# Altium schematic sheet Interface.SchDoc
size A4; SheetNumber: 3; SheetTotal: 4
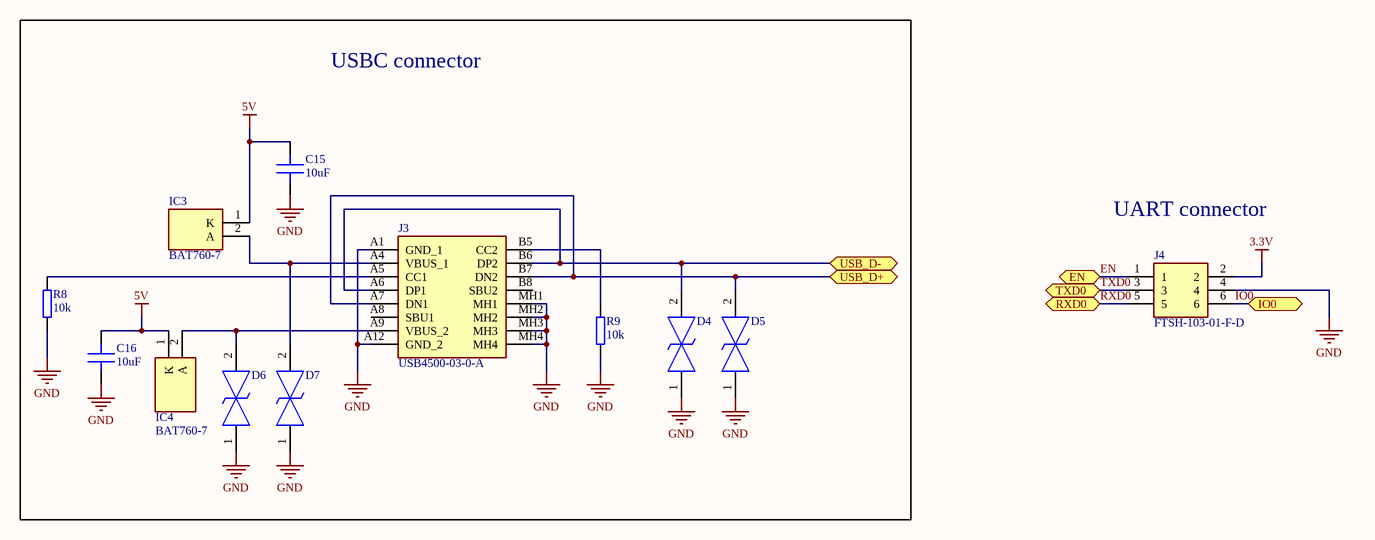
[diagram p0: Interface.SchDoc]

## Parts
C15  10uF  [C 0402]
C16  10uF  [C 0402]
D4  LESD5D5.0CT1G  [LESD5D50CT1G]  (value not drawn)
D5  LESD5D5.0CT1G  [LESD5D50CT1G]  (value not drawn)
D6  LESD5D5.0CT1G  [LESD5D50CT1G]  (value not drawn)
D7  LESD5D5.0CT1G  [LESD5D50CT1G]  (value not drawn)
IC3  BAT760-7  [SOD2513X120N]
IC4  BAT760-7  [SOD2513X120N]
J3  USB4500-03-0-A  [USB4500030A]
J4  FTSH-103-01-F-D  [FTSH-103-XX-YYY-D]
R8  10k  [R 0402]
R9  10k  [R 0402]

## Blocks framed on the sheet
USBC connector: C15 C16 D4-D7 IC3 IC4 J3 R8 R9

## Ports
EN (bidir), IO0 (bidir), RXD0 (bidir), TXD0 (bidir), USB_D+ (bidir), USB_D- (bidir)

## Nets
3.3V: J4.2
5V: C15.1 C16.1 IC3.1(K) IC4.1(K)
GND: C15.2 C16.2 D4.1 D5.1 D6.1 D7.1 J3.A1(GND_1) J3.A12(GND_2) J3.MH1 J3.MH2 J3.MH3 J3.MH4 J4.4 R8.1 R9.1
EN: J4.1 ; port EN
IO0: J4.6 ; port IO0
RXD0: J4.5 ; port RXD0
TXD0: J4.3 ; port TXD0
USB_D+: D5.2 J3.A7(DN1) J3.B7(DN2) ; port USB_D+
USB_D-: D4.2 J3.A6(DP1) J3.B6(DP2) ; port USB_D-
NetD6_2: D6.2 IC4.2(A) J3.A9(VBUS_2)
NetD7_2: D7.2 IC3.2(A) J3.A4(VBUS_1)
NetJ3_A5: J3.A5(CC1) R8.2
NetJ3_B5: J3.B5(CC2) R9.2

Not connected (* = marked no-connect by the designer): J3 A8(SBU1) B8(SBU2)

## Notes on the sheet
- UART connector

## Library data of the parts
C15 C16 = Capacitor: MLCC Capacitor
D4-D7 = LESD5D5.0CT1G: TVS Diode (Bi-directional); Manufacturer_Name: LRC; Height: 0.7mm; Manufacturer_Part_Number: LESD5D5.0CT1G
IC3 IC4 = BAT760-7: Integrated Circuit; Manufacturer_Name: Lattice Semiconductor; Datasheet Link: https://www.diodes.com/assets/Datasheets/ds30498.pdf; Height: 1.2mm; Manufacturer_Part_Number: BAT760-7; Mouser Part Number: N/A; Mouser Price/Stock: https://www.mouser.com/Search/Refine.aspx?Keyword=N%2FA
J3 = USB4500-03-0-A: Connector; Manufacturer_Name: GCT (GLOBAL CONNECTOR TECHNOLOGY); Datasheet Link: https://componentsearchengine.com/Datasheets/2/USB4500-03-0-A.pdf; Manufacturer_Part_Number: USB4500-03-0-A; Mouser Part Number: 640-USB4500030A; Mouser Price/Stock: https://www.mouser.co.uk/ProductDetail/GCT/USB4500-03-0-A?qs=7D1LtPJG0i2mVyw7UtV%2FkQ%3D%3D
J4 = FTSH-103-01-F-D: Connector; Manufacturer_Name: SAMTEC; Datasheet Link: http://suddendocs.samtec.com/prints/ftsh-1xx-xx-xxx-d-xxx-xx-mkt.pdf; Manufacturer_Part_Number: FTSH-103-01-F-D; Mouser Part Number: 200-FTSH10301FD; Mouser Price/Stock: https://www.mouser.co.uk/ProductDetail/Samtec/FTSH-103-01-F-D?qs=0lQeLiL1qyb7OHmlWV4egA%3D%3D; Arrow Part Number: FTSH-103-01-F-D; Arrow Price/Stock: https://www.arrow.com/en/products/ftsh-103-01-f-d/samtec
R8 R9 = Resistor: General pourpouse resistor